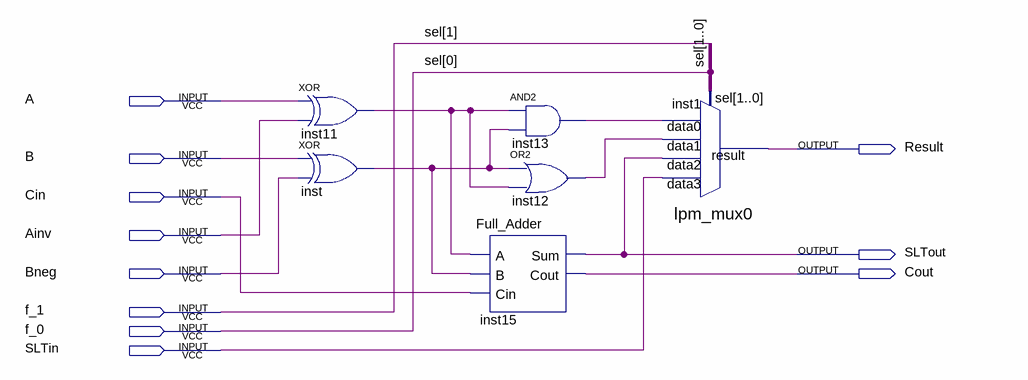
[diagram p0: schematic sheet]
// Quartus schematic ALU_Slice.bdf as structural Verilog: 6 symbols, 11 pins
module ALU_Slice (
  input  A,
  input  B,
  input  Cin,
  input  Ainv,
  input  Bneg,
  input  f_1,
  input  f_0,
  input  SLTin,
  output Result,
  output SLTout,
  output Cout
);

  wire inst11_out, inst12_out, inst13_out, inst_out;

  xor inst11 (inst11_out, A, Ainv);
  xor inst (inst_out, B, Bneg);
  and inst13 (inst13_out, inst11_out, inst_out);
  or inst12 (inst12_out, inst_out, inst11_out);
  Full_Adder inst15 (.A(inst11_out), .B(inst_out), .Cin(Cin), .Sum(SLTout), .Cout(Cout));
  lpm_mux0 inst1 (
    .data3(SLTin), .data2(SLTout), .data1(inst12_out), .data0(inst13_out), .sel({f_1, f_0}), .result(Result));

  // Other names for the same wires on the sheet: sel[1:0] = {f_1, f_0}
endmodule
